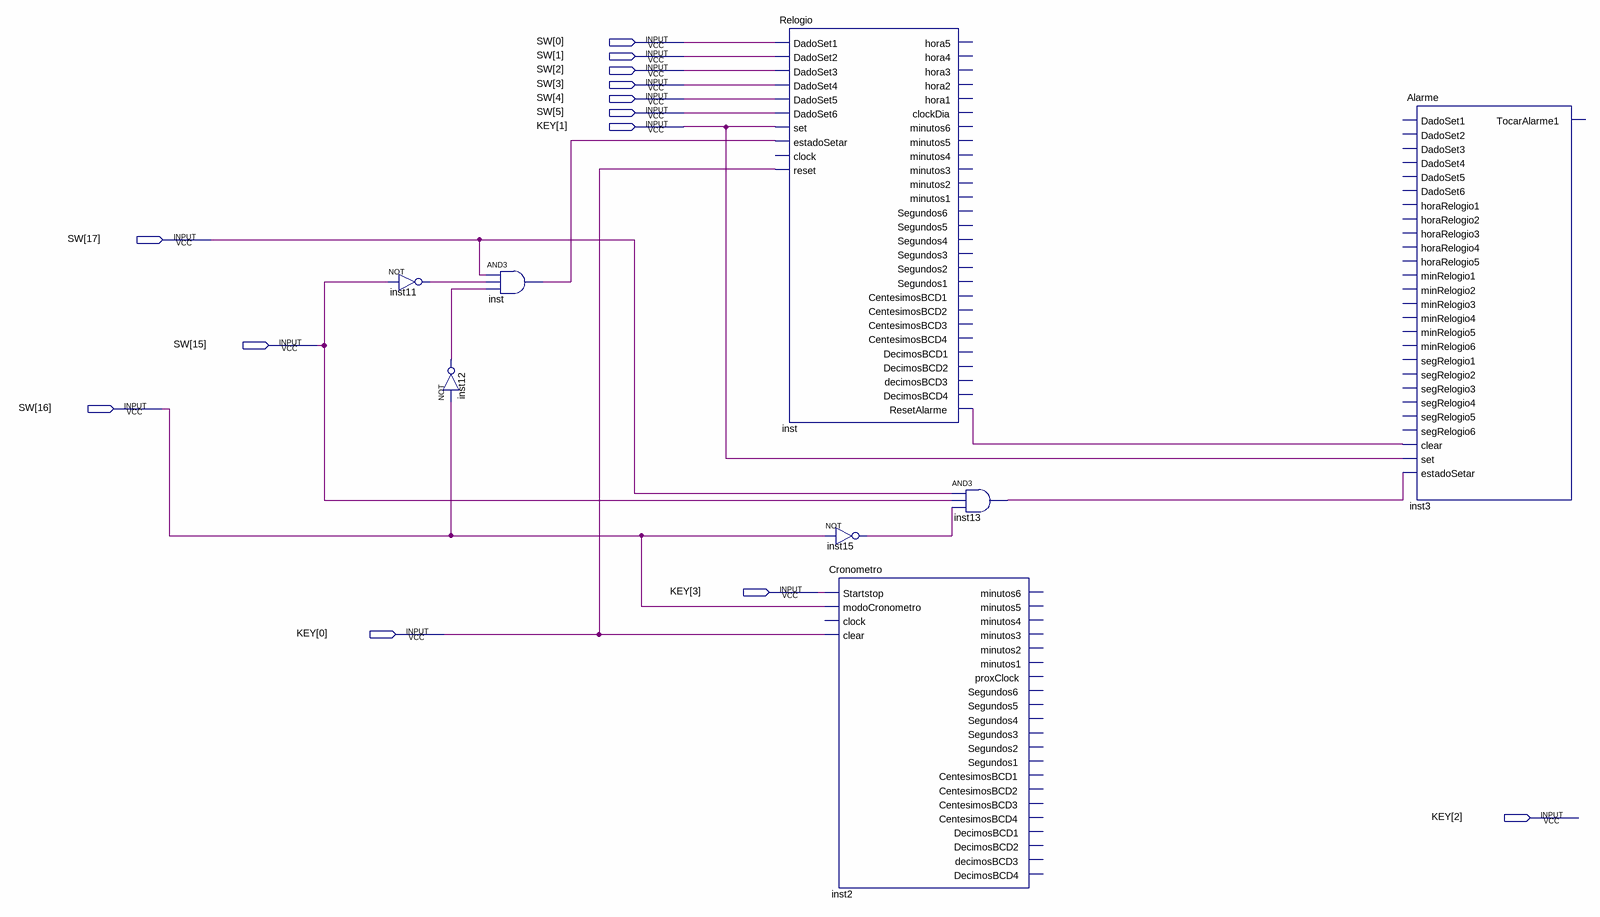
[diagram p0: schematic sheet]
// Quartus schematic TrabalhoFinal.bdf as structural Verilog: 8 symbols, 13 pins
module TrabalhoFinal (
  input  [17:0] SW,
  input  [3:0] KEY
);

  wire inst11_out, inst12_out, inst13_out, inst15_out, inst_out, inst_resetalarme;

  not inst11 (inst11_out, SW[15]);
  not inst12 (inst12_out, SW[16]);
  and inst (inst_out, SW[17], inst11_out, inst12_out);
  Relogio inst_dup2 (
    .DadoSet1(SW[0]), .DadoSet2(SW[1]), .DadoSet3(SW[2]), .DadoSet4(SW[3]), .DadoSet5(SW[4]),
    .DadoSet6(SW[5]), .set(KEY[1]), .estadoSetar(inst_out), .reset(KEY[0]), .ResetAlarme(inst_resetalarme));  // open: clock, hora5, hora4, hora3, hora2, hora1, clockDia, minutos6, minutos5, minutos4, minutos3, minutos2, minutos1, Segundos6, Segundos5, Segundos4, Segundos3, Segundos2, Segundos1, CentesimosBCD1, CentesimosBCD2, CentesimosBCD3, CentesimosBCD4, DecimosBCD1, DecimosBCD2, decimosBCD3, DecimosBCD4
  not inst15 (inst15_out, SW[16]);
  Cronometro inst2 (
    .Startstop(KEY[3]), .modoCronometro(SW[16]), .clear(KEY[0]));  // open: clock, minutos6, minutos5, minutos4, minutos3, minutos2, minutos1, proxClock, Segundos6, Segundos5, Segundos4, Segundos3, Segundos2, Segundos1, CentesimosBCD1, CentesimosBCD2, CentesimosBCD3, CentesimosBCD4, DecimosBCD1, DecimosBCD2, decimosBCD3, DecimosBCD4
  and inst13 (inst13_out, SW[17], SW[15], inst15_out);
  Alarme inst3 (
    .clear(inst_resetalarme), .set(KEY[1]), .estadoSetar(inst13_out));  // open: DadoSet1, DadoSet2, DadoSet3, DadoSet4, DadoSet5, DadoSet6, horaRelogio1, horaRelogio2, horaRelogio3, horaRelogio4, horaRelogio5, minRelogio1, minRelogio2, minRelogio3, minRelogio4, minRelogio5, minRelogio6, segRelogio1, segRelogio2, segRelogio3, segRelogio4, segRelogio5, segRelogio6, TocarAlarme1
endmodule
